# Altium schematic sheet START_JUMPER.SchDoc
size A4; SheetNumber: 8; SheetTotal: 8
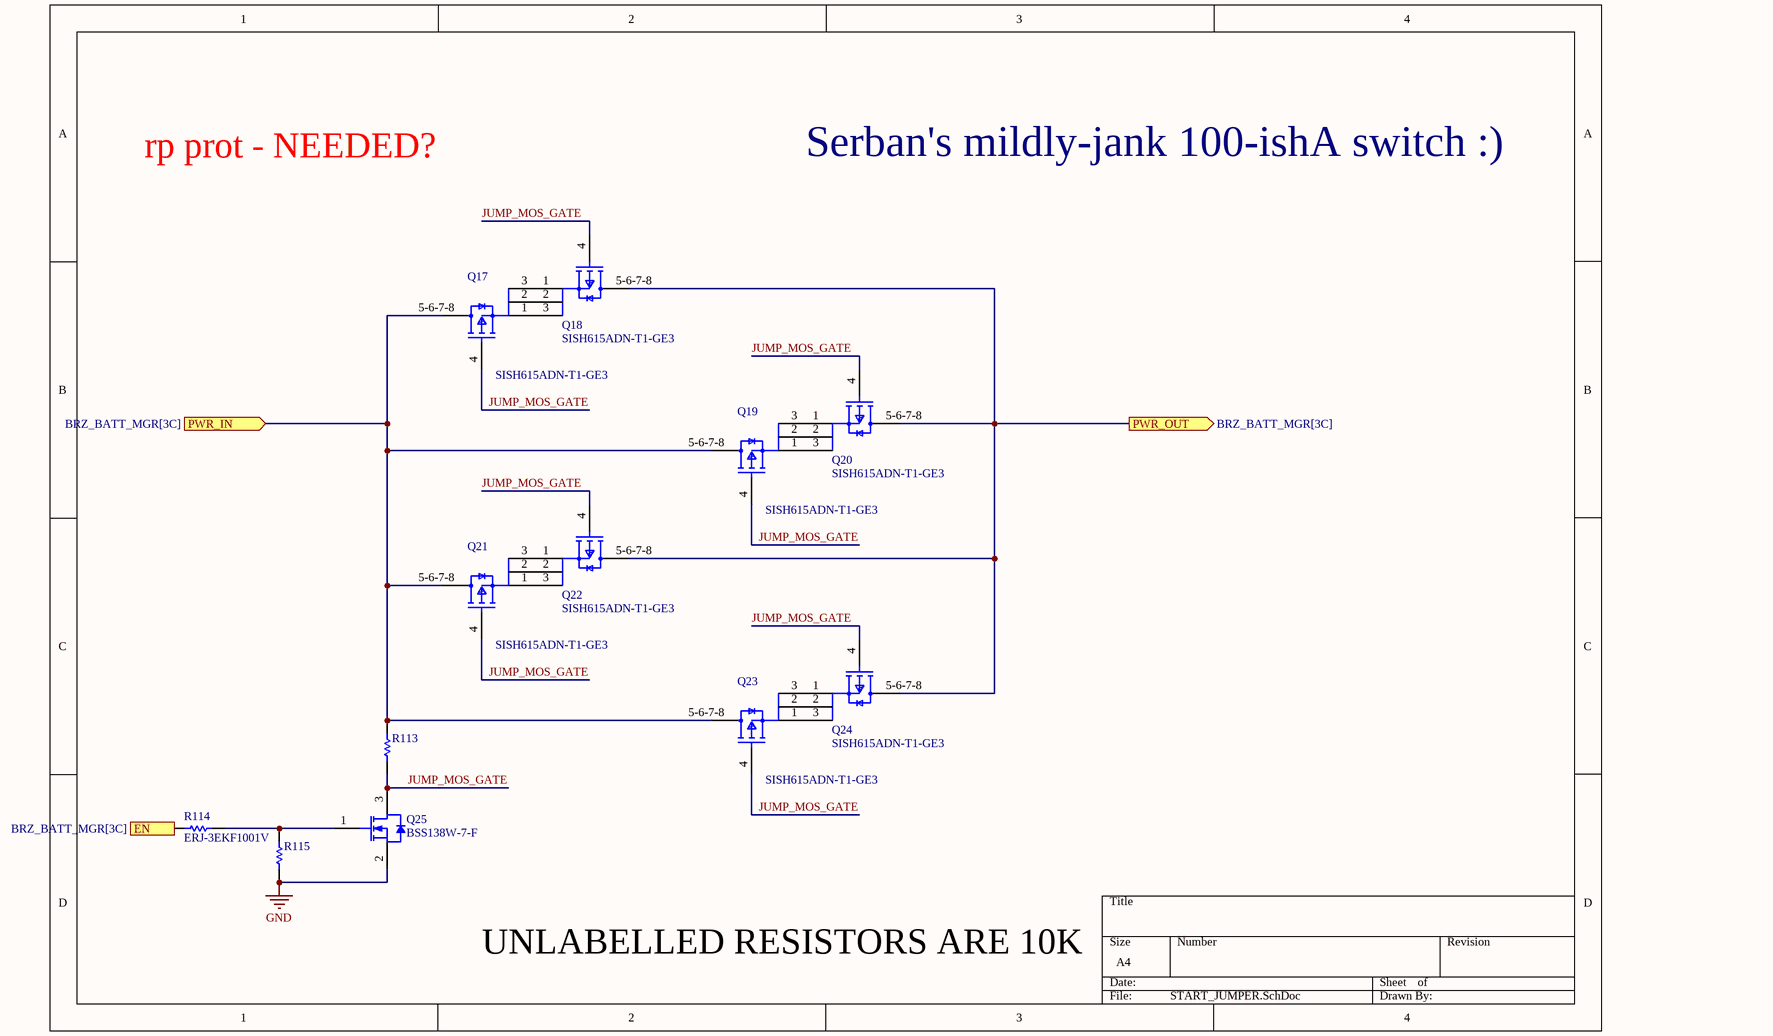
[diagram p0: START_JUMPER.SchDoc]

## Parts
Q17  SISH615ADN-T1-GE3  [SISH615ADN-T1-GE3-Footprint-1]
Q18  SISH615ADN-T1-GE3  [SISH615ADN-T1-GE3-Footprint-1]
Q19  SISH615ADN-T1-GE3  [SISH615ADN-T1-GE3-Footprint-1]
Q20  SISH615ADN-T1-GE3  [SISH615ADN-T1-GE3-Footprint-1]
Q21  SISH615ADN-T1-GE3  [SISH615ADN-T1-GE3-Footprint-1]
Q22  SISH615ADN-T1-GE3  [SISH615ADN-T1-GE3-Footprint-1]
Q23  SISH615ADN-T1-GE3  [SISH615ADN-T1-GE3-Footprint-1]
Q24  SISH615ADN-T1-GE3  [SISH615ADN-T1-GE3-Footprint-1]
Q25  BSS138W-7-F  [DIOD-SOT323-3_V]
R113  ERJ3EKF1002V  [RESC1609X55X30LL15T15]  (value not drawn)
R114  ERJ-3EKF1001V  [RESC1608X55X30LL15T15]
R115  ERJ3EKF1002V  [RESC1609X55X30LL15T15]  (value not drawn)

## Ports
EN (in, see BRZ_BATT_MGR[3C]), PWR_IN (in, see BRZ_BATT_MGR[3C]), PWR_OUT (out, see BRZ_BATT_MGR[3C])

## Nets
GND: Q25.2(S) R115.1
JUMP_MOS_GATE: Q17.4(G) Q18.4(G) Q19.4(G) Q20.4(G) Q21.4(G) Q22.4(G) Q23.4(G) Q24.4(G) Q25.3(D) R113.1
PWR_IN: Q17.5-6-7-8(D) Q19.5-6-7-8(D) Q21.5-6-7-8(D) Q23.5-6-7-8(D) R113.2 ; port PWR_IN
PWR_OUT: Q18.5-6-7-8(D) Q20.5-6-7-8(D) Q22.5-6-7-8(D) Q24.5-6-7-8(D) ; port PWR_OUT
NetQ17_1: Q17.1(S) Q18.3(S)
NetQ17_2: Q17.2(S) Q18.2(S)
NetQ17_3: Q17.3(S) Q18.1(S)
NetQ19_1: Q19.1(S) Q20.3(S)
NetQ19_2: Q19.2(S) Q20.2(S)
NetQ19_3: Q19.3(S) Q20.1(S)
NetQ21_1: Q21.1(S) Q22.3(S)
NetQ21_2: Q21.2(S) Q22.2(S)
NetQ21_3: Q21.3(S) Q22.1(S)
NetQ23_1: Q23.1(S) Q24.3(S)
NetQ23_2: Q23.2(S) Q24.2(S)
NetQ23_3: Q23.3(S) Q24.1(S)
NetQ25_1: Q25.1(G) R114.1 R115.2

Not connected (* = marked no-connect by the designer): R114 2

## Notes on the sheet
- rp prot - NEEDED?
- Serban's mildly-jank 100-ishA switch :)
- UNLABELLED RESISTORS ARE 10K

## Library data of the parts
Q17-Q24 = CMP-013-00036-1: Trans MOSFET P-CH 20V 22.1A 8-Pin PowerPAK 1212 EP T/R
Q25 = CMP-2000-05968-1: N-Channel Enhancement Mode Mosfet, 50 V, 200 mA, -55 to 150 degC, 6-Pin SOT-323, RoHS, Tape and Reel; Typical Turn-Off Delay Time: 20ns; Number of Channels: 1Channel; Type: EnhancementModeFieldEffectTransistor; Brand: DiodesIncorporated; Vds - Drain-Source Breakdown Voltage: 75V; Vgs - Gate-Source Voltage: 20V; Rds On - Drain-Source Resistance: 1.4Ohms; Transistor Type: 1N-Channel; Configuration: Single; Unit Weight: 0.000212oz; Pd - Power Dissipation: 200mW; Id - Continuous Drain Current: 200mA; Forward Transconductance - Min: 0.1S; Manufacturer URL: http://www.diodes.com/; Series: BSS138; Package Description: 3-Pin Small Outline Transistor, Body 2 x 1.25 mm, Pitch 0.65 mm; Mounting Technology: SurfaceMount; Product Category: MOSFET; RoHS: True; Maximum Operating Temperature: +150C; Height: 1mm; Length: 2.2mm; Technology: Si; Width: 1.35mm; Datasheet URL: http://www.diodes.com/_files/datasheets/ds30206.pdf; Manufacturer: DiodesIncorporated; Package / Case: SOT-323-3; Typical Turn-On Delay Time: 20ns; Transistor Polarity: N-Channel; Factory Pack Quantity: 3000; Packaging: Reel; Product: MOSFETSmallSignal; Datasheet Version: Rev. 11-2, 09/2013; Package Reference: SOT323; Minimum Operating Temperature: -55C; Mounting Style: SMD/SMT; Channel Mode: Enhancement
R113 R115 = CMP-1012-00623-3: Chip Resistor, 10 KOhm, +/- 1%, 0.1 W, -55 to 155 degC, 0603 (1608 Metric), RoHS, Tape and Reel; Manufacturer: Panasonic; Voltage Rating: 75V; Case\/Package: 0603; Power Rating: 100mW; Resistance: 10KOhm; Temperature Coefficient: 100ppm\/degreesC; Number of Pins: 2; Package Reference: 603; Depth: 0.8mm; Mount: SurfaceMount; Package Description: 2-Pin Surface Mount Device, Body 1.6 x 0.85 mm; Datasheet Version: 02/2017; Length: 1.6mm; Lead Free: LeadFree; Height: 0.45mm; Number of Terminations: 2; Max Power Dissipation: 100mW; Min Operating Temperature: -55degC; Datasheet URL: https://industrial.panasonic.com/cdbs/www-data/pdf/RDA0000/AOA0000C304.pdf; Termination: SMD/SMT; Case Code (Metric): 1608; Case Code (Imperial): 0603; Tolerance: 1%; Max Operating Temperature: 155degC; RoHSCompliant: true; Voltage Rating (DC): 75V; Radiation Hardening: No; Packaging: TapeandReel; Composition: ThickFilm; Mounting Technology: SurfaceMount; Manufacturer URL: http://www.panasonic.com/; Width: 0.031inch; REACH SVHC: NoSVHC; Contact Plating: Tin; Military Standard: Not; Package Quantity: 1
R114 = CMP-2000-00180-1: Manufacturer: Panasonic; Part Number: ERJ-3EKF1001V